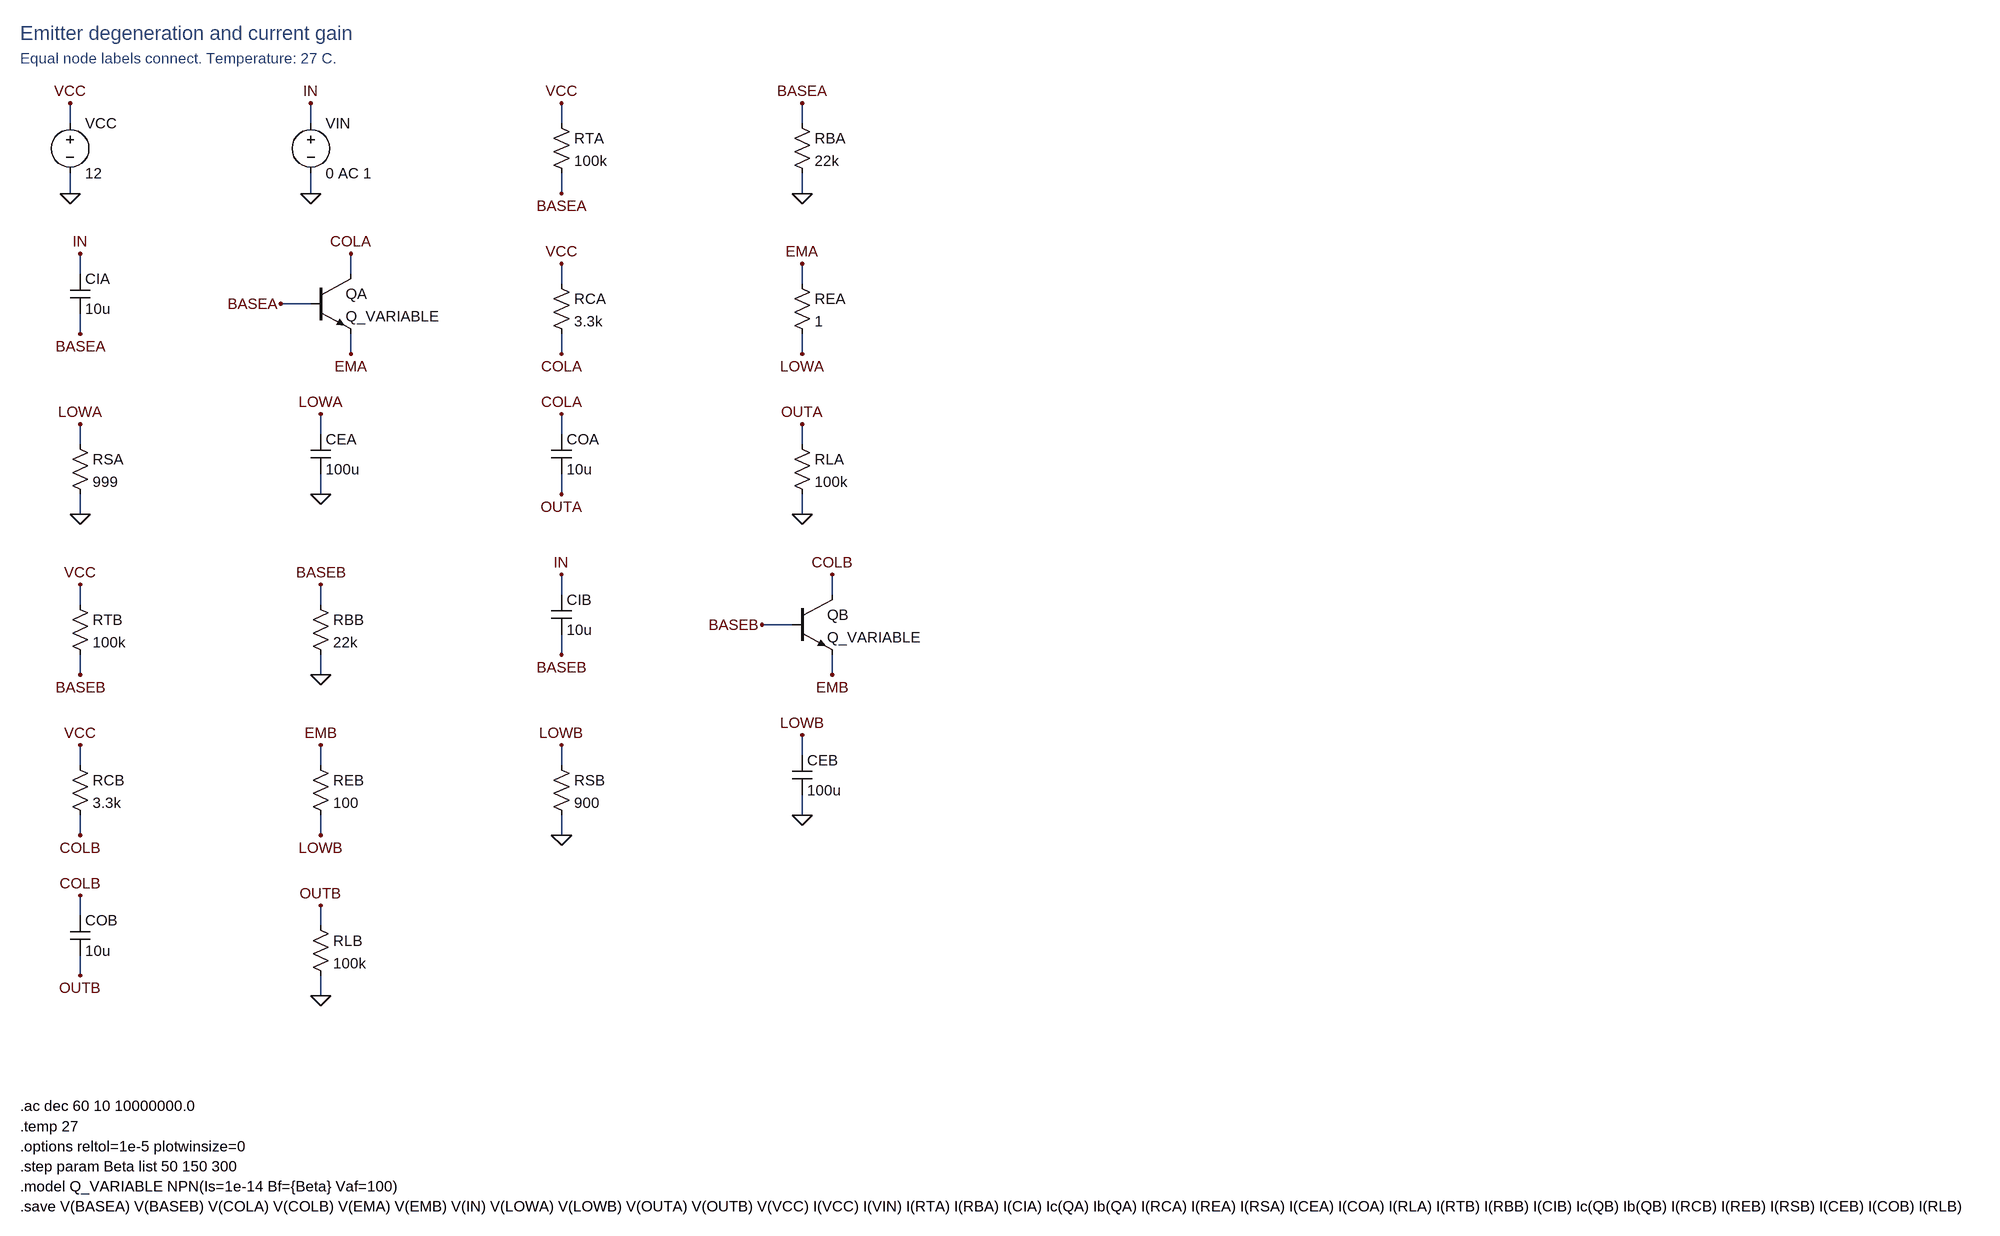
[diagram p0: schematic emitter-degeneration.asc]
emitter-degeneration.asc, the LTspice schematic file:
Version 4
SHEET 1 1740 2056
WIRE 144 176 144 144
WIRE 144 256 144 288
WIRE 528 176 528 144
WIRE 528 256 528 288
WIRE 928 176 928 144
WIRE 928 256 928 288
WIRE 1312 176 1312 144
WIRE 1312 256 1312 288
WIRE 160 416 160 384
WIRE 160 480 160 512
WIRE 592 416 592 384
WIRE 528 464 480 464
WIRE 592 512 592 544
WIRE 928 432 928 400
WIRE 928 512 928 544
WIRE 1312 432 1312 400
WIRE 1312 512 1312 544
WIRE 160 688 160 656
WIRE 160 768 160 800
WIRE 544 672 544 640
WIRE 544 736 544 768
WIRE 928 672 928 640
WIRE 928 736 928 768
WIRE 1312 688 1312 656
WIRE 1312 768 1312 800
WIRE 160 944 160 912
WIRE 160 1024 160 1056
WIRE 544 944 544 912
WIRE 544 1024 544 1056
WIRE 928 928 928 896
WIRE 928 992 928 1024
WIRE 1360 928 1360 896
WIRE 1296 976 1248 976
WIRE 1360 1024 1360 1056
WIRE 160 1200 160 1168
WIRE 160 1280 160 1312
WIRE 544 1200 544 1168
WIRE 544 1280 544 1312
WIRE 928 1200 928 1168
WIRE 928 1280 928 1312
WIRE 1312 1184 1312 1152
WIRE 1312 1248 1312 1280
WIRE 160 1440 160 1408
WIRE 160 1504 160 1536
WIRE 544 1456 544 1424
WIRE 544 1536 544 1568
FLAG 144 144 VCC
FLAG 144 288 0
FLAG 528 144 IN
FLAG 528 288 0
FLAG 928 144 VCC
FLAG 928 288 BASEA
FLAG 1312 144 BASEA
FLAG 1312 288 0
FLAG 160 384 IN
FLAG 160 512 BASEA
FLAG 592 384 COLA
FLAG 480 464 BASEA
FLAG 592 544 EMA
FLAG 928 400 VCC
FLAG 928 544 COLA
FLAG 1312 400 EMA
FLAG 1312 544 LOWA
FLAG 160 656 LOWA
FLAG 160 800 0
FLAG 544 640 LOWA
FLAG 544 768 0
FLAG 928 640 COLA
FLAG 928 768 OUTA
FLAG 1312 656 OUTA
FLAG 1312 800 0
FLAG 160 912 VCC
FLAG 160 1056 BASEB
FLAG 544 912 BASEB
FLAG 544 1056 0
FLAG 928 896 IN
FLAG 928 1024 BASEB
FLAG 1360 896 COLB
FLAG 1248 976 BASEB
FLAG 1360 1056 EMB
FLAG 160 1168 VCC
FLAG 160 1312 COLB
FLAG 544 1168 EMB
FLAG 544 1312 LOWB
FLAG 928 1168 LOWB
FLAG 928 1312 0
FLAG 1312 1152 LOWB
FLAG 1312 1280 0
FLAG 160 1408 COLB
FLAG 160 1536 OUTB
FLAG 544 1424 OUTB
FLAG 544 1568 0
SYMBOL voltage 144 160 R0
SYMATTR InstName VCC
SYMATTR Value 12
SYMBOL voltage 528 160 R0
SYMATTR InstName VIN
SYMATTR Value 0 AC 1
SYMBOL res 912 160 R0
SYMATTR InstName RTA
SYMATTR Value 100k
SYMBOL res 1296 160 R0
SYMATTR InstName RBA
SYMATTR Value 22k
SYMBOL cap 144 416 R0
SYMATTR InstName CIA
SYMATTR Value 10u
SYMBOL npn 528 416 R0
SYMATTR InstName QA
SYMATTR Value Q_VARIABLE
SYMBOL res 912 416 R0
SYMATTR InstName RCA
SYMATTR Value 3.3k
SYMBOL res 1296 416 R0
SYMATTR InstName REA
SYMATTR Value 1
SYMBOL res 144 672 R0
SYMATTR InstName RSA
SYMATTR Value 999
SYMBOL cap 528 672 R0
SYMATTR InstName CEA
SYMATTR Value 100u
SYMBOL cap 912 672 R0
SYMATTR InstName COA
SYMATTR Value 10u
SYMBOL res 1296 672 R0
SYMATTR InstName RLA
SYMATTR Value 100k
SYMBOL res 144 928 R0
SYMATTR InstName RTB
SYMATTR Value 100k
SYMBOL res 528 928 R0
SYMATTR InstName RBB
SYMATTR Value 22k
SYMBOL cap 912 928 R0
SYMATTR InstName CIB
SYMATTR Value 10u
SYMBOL npn 1296 928 R0
SYMATTR InstName QB
SYMATTR Value Q_VARIABLE
SYMBOL res 144 1184 R0
SYMATTR InstName RCB
SYMATTR Value 3.3k
SYMBOL res 528 1184 R0
SYMATTR InstName REB
SYMATTR Value 100
SYMBOL res 912 1184 R0
SYMATTR InstName RSB
SYMATTR Value 900
SYMBOL cap 1296 1184 R0
SYMATTR InstName CEB
SYMATTR Value 100u
SYMBOL cap 144 1440 R0
SYMATTR InstName COB
SYMATTR Value 10u
SYMBOL res 528 1440 R0
SYMATTR InstName RLB
SYMATTR Value 100k
TEXT 64 32 Left 3 ;Emitter degeneration and current gain
TEXT 64 72 Left 2 ;Equal node labels connect. Temperature: 27 C.
TEXT 64 1744 Left 2 !.ac dec 60 10 10000000.0
TEXT 64 1776 Left 2 !.temp 27
TEXT 64 1808 Left 2 !.options reltol=1e-5 plotwinsize=0
TEXT 64 1840 Left 2 !.step param Beta list 50 150 300
TEXT 64 1872 Left 2 !.model Q_VARIABLE NPN(Is=1e-14 Bf={Beta} Vaf=100)
TEXT 64 1904 Left 2 !.save V(BASEA) V(BASEB) V(COLA) V(COLB) V(EMA) V(EMB) V(IN) V(LOWA) V(LOWB) V(OUTA) V(OUTB) V(VCC) I(VCC) I(VIN) I(RTA) I(RBA) I(CIA) Ic(QA) Ib(QA) I(RCA) I(REA) I(RSA) I(CEA) I(COA) I(RLA) I(RTB) I(RBB) I(CIB) Ic(QB) Ib(QB) I(RCB) I(REB) I(RSB) I(CEB) I(COB) I(RLB)

The netlist it stands for:
* emitter-degeneration.asc
VCC VCC 0 12
VIN IN 0 0 AC 1
RTA VCC BASEA 100k
RBA BASEA 0 22k
CIA IN BASEA 10u
QA COLA BASEA EMA 0 Q_VARIABLE
RCA VCC COLA 3.3k
REA EMA LOWA 1
RSA LOWA 0 999
CEA LOWA 0 100u
COA COLA OUTA 10u
RLA OUTA 0 100k
RTB VCC BASEB 100k
RBB BASEB 0 22k
CIB IN BASEB 10u
QB COLB BASEB EMB 0 Q_VARIABLE
RCB VCC COLB 3.3k
REB EMB LOWB 100
RSB LOWB 0 900
CEB LOWB 0 100u
COB COLB OUTB 10u
RLB OUTB 0 100k
.model NPN NPN
.model PNP PNP
.lib standard.bjt
* Emitter degeneration and current gain
* Equal node labels connect. Temperature: 27 C.
.ac dec 60 10 10000000.0
.temp 27
.options reltol=1e-5 plotwinsize=0
.step param Beta list 50 150 300
.model Q_VARIABLE NPN(Is=1e-14 Bf={Beta} Vaf=100)
.save V(BASEA) V(BASEB) V(COLA) V(COLB) V(EMA) V(EMB) V(IN) V(LOWA) V(LOWB) V(OUTA) V(OUTB) V(VCC) I(VCC) I(VIN) I(RTA) I(RBA) I(CIA) Ic(QA) Ib(QA) I(RCA) I(REA) I(RSA) I(CEA) I(COA) I(RLA) I(RTB) I(RBB) I(CIB) Ic(QB) Ib(QB) I(RCB) I(REB) I(RSB) I(CEB) I(COB) I(RLB)
.backanno
.end